# Altium schematic sheet Sheet1.SchDoc
size A4; SheetNumber: 1; SheetTotal: 1; SPICEModelCacheOYZCGGNQ: <root> / <DocumentId>OYZCGGNQ</DocumentId> / </root>
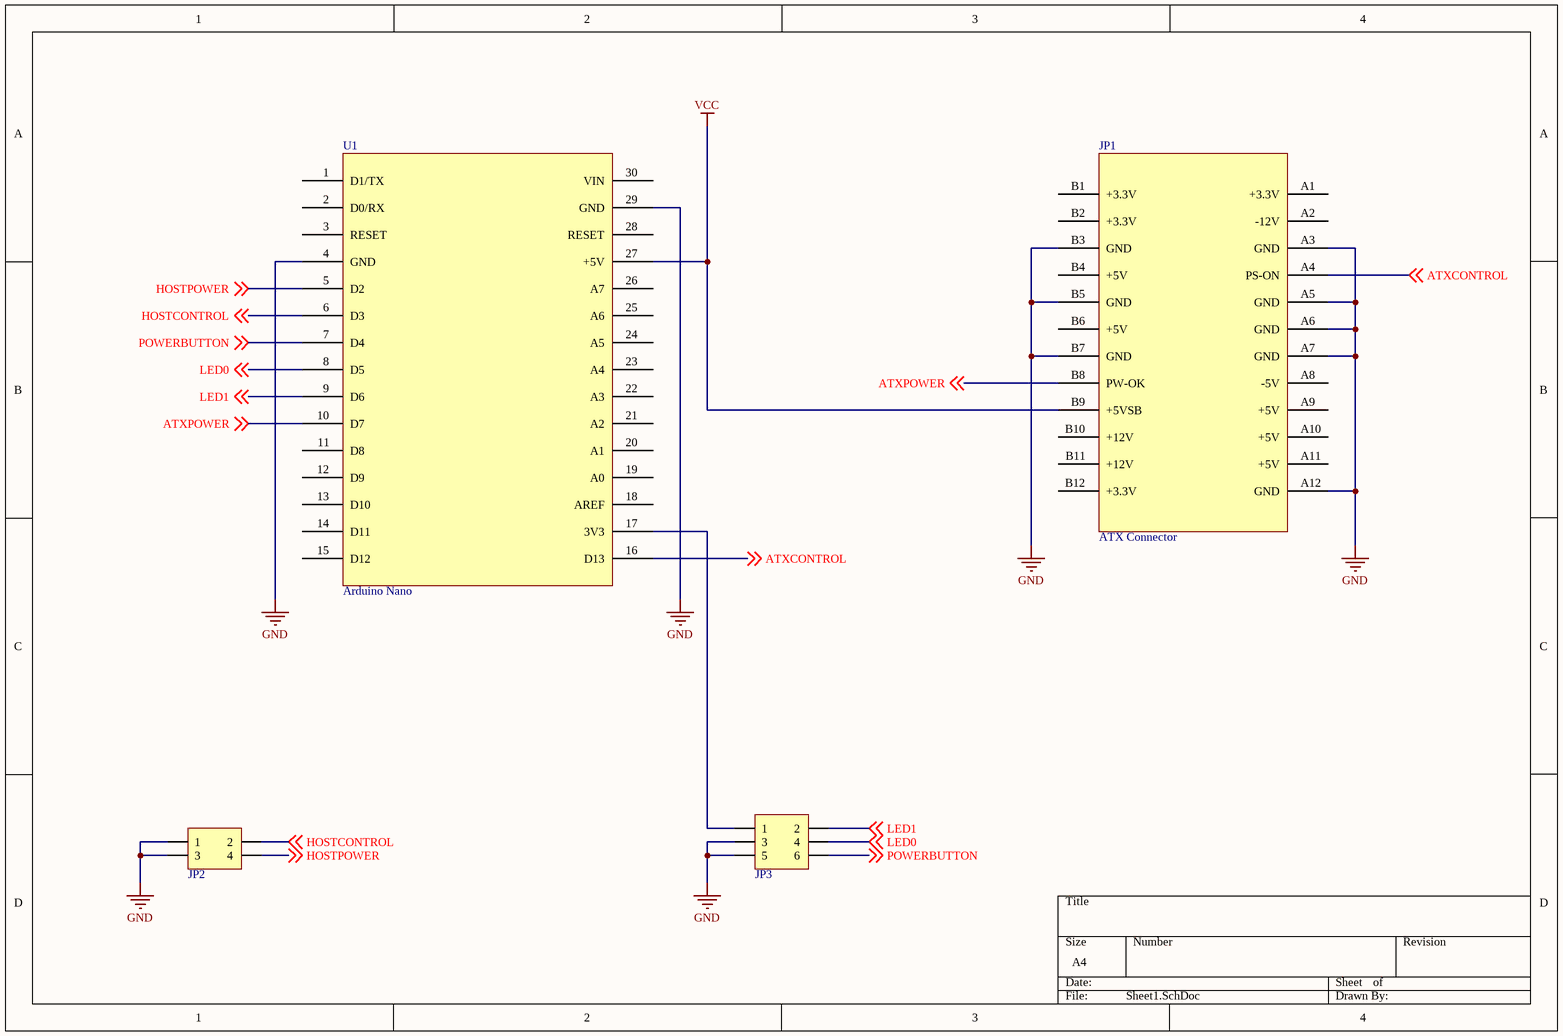
[diagram p0: Sheet1.SchDoc]

## Parts
JP1  ATX Connector  [ATX Connector]
JP2  Header2X2  [HDR2.54-LI-2x2P]  (value not drawn)
JP3  Header3X2  [HDR2.54-LI-2x3P]  (value not drawn)
U1  Arduino Nano  [ArduinoNanoDIP30]

## Nets
GND: JP1.A3(GND) JP1.A5(GND) JP1.A6(GND) JP1.A7(GND) JP1.A12(GND) JP1.B3(GND) JP1.B5(GND) JP1.B7(GND) JP2.1 JP2.3 JP3.3 JP3.5 U1.4(GND) U1.29(GND)
VCC: JP1.B9(+5VSB) U1.27(+5V)
ATXCONTROL: JP1.A4(PS-ON) U1.16(D13) ; off-sheet ATXCONTROL
ATXPOWER: JP1.B8(PW-OK) U1.10(D7) ; off-sheet ATXPOWER
HOSTCONTROL: JP2.2 U1.6(D3) ; off-sheet HOSTCONTROL
HOSTPOWER: JP2.4 U1.5(D2) ; off-sheet HOSTPOWER
LED0: JP3.4 U1.8(D5) ; off-sheet LED0
LED1: JP3.2 U1.9(D6) ; off-sheet LED1
POWERBUTTON: JP3.6 U1.7(D4) ; off-sheet POWERBUTTON
NetJP3_1: JP3.1 U1.17(3V3)

Not connected (* = marked no-connect by the designer): JP1 A1(+3.3V) A2(-12V) A8(-5V) A9(+5V) A10(+5V) A11(+5V) B1(+3.3V) B2(+3.3V) B4(+5V) B6(+5V) B10(+12V) B11(+12V) B12(+3.3V); U1 1(D1/TX) 2(D0/RX) 3(RESET) 11(D8) 12(D9) 13(D10) 14(D11) 15(D12) 18(AREF) 19(A0) 20(A1) 21(A2) 22(A3) 23(A4) 24(A5) 25(A6) 26(A7) 28(RESET) 30(VIN)

## Library data of the parts
JP1 = ATX Connector: 4.2mm间距 5557-20P/24P 焊板式 板对板 连接器 2*12直针座
JP2 = Header 2X2: 2*2P接插件; 版权归属: 封装库来自淘宝 ID：黄晶宝石; BOM名称: 2*2P接插件; 学习资源: https://shop463601444.taobao.com
JP3 = Header 3X2: 3*2P接插件; 版权归属: 封装库来自淘宝 ID：黄晶宝石; BOM名称: 3*2P接插件; 学习资源: https://shop463601444.taobao.com
U1 = Arduino Nano: Arduino Nano Board V3.0